# Altium project LimeNet-Micro_2v1-SDR.PrjPcb (part 3 of 10)

## Sheet 09_Misc.SchDoc: Misc
size A3; Organization: Lime Microsystems; Address1: Surrey Tech Centre; Address2: Guildford GU2 7YG; Address3: Surrey; Address4: United Kingdom; Revision: v2.1; SheetNumber: 9; SheetTotal: 15
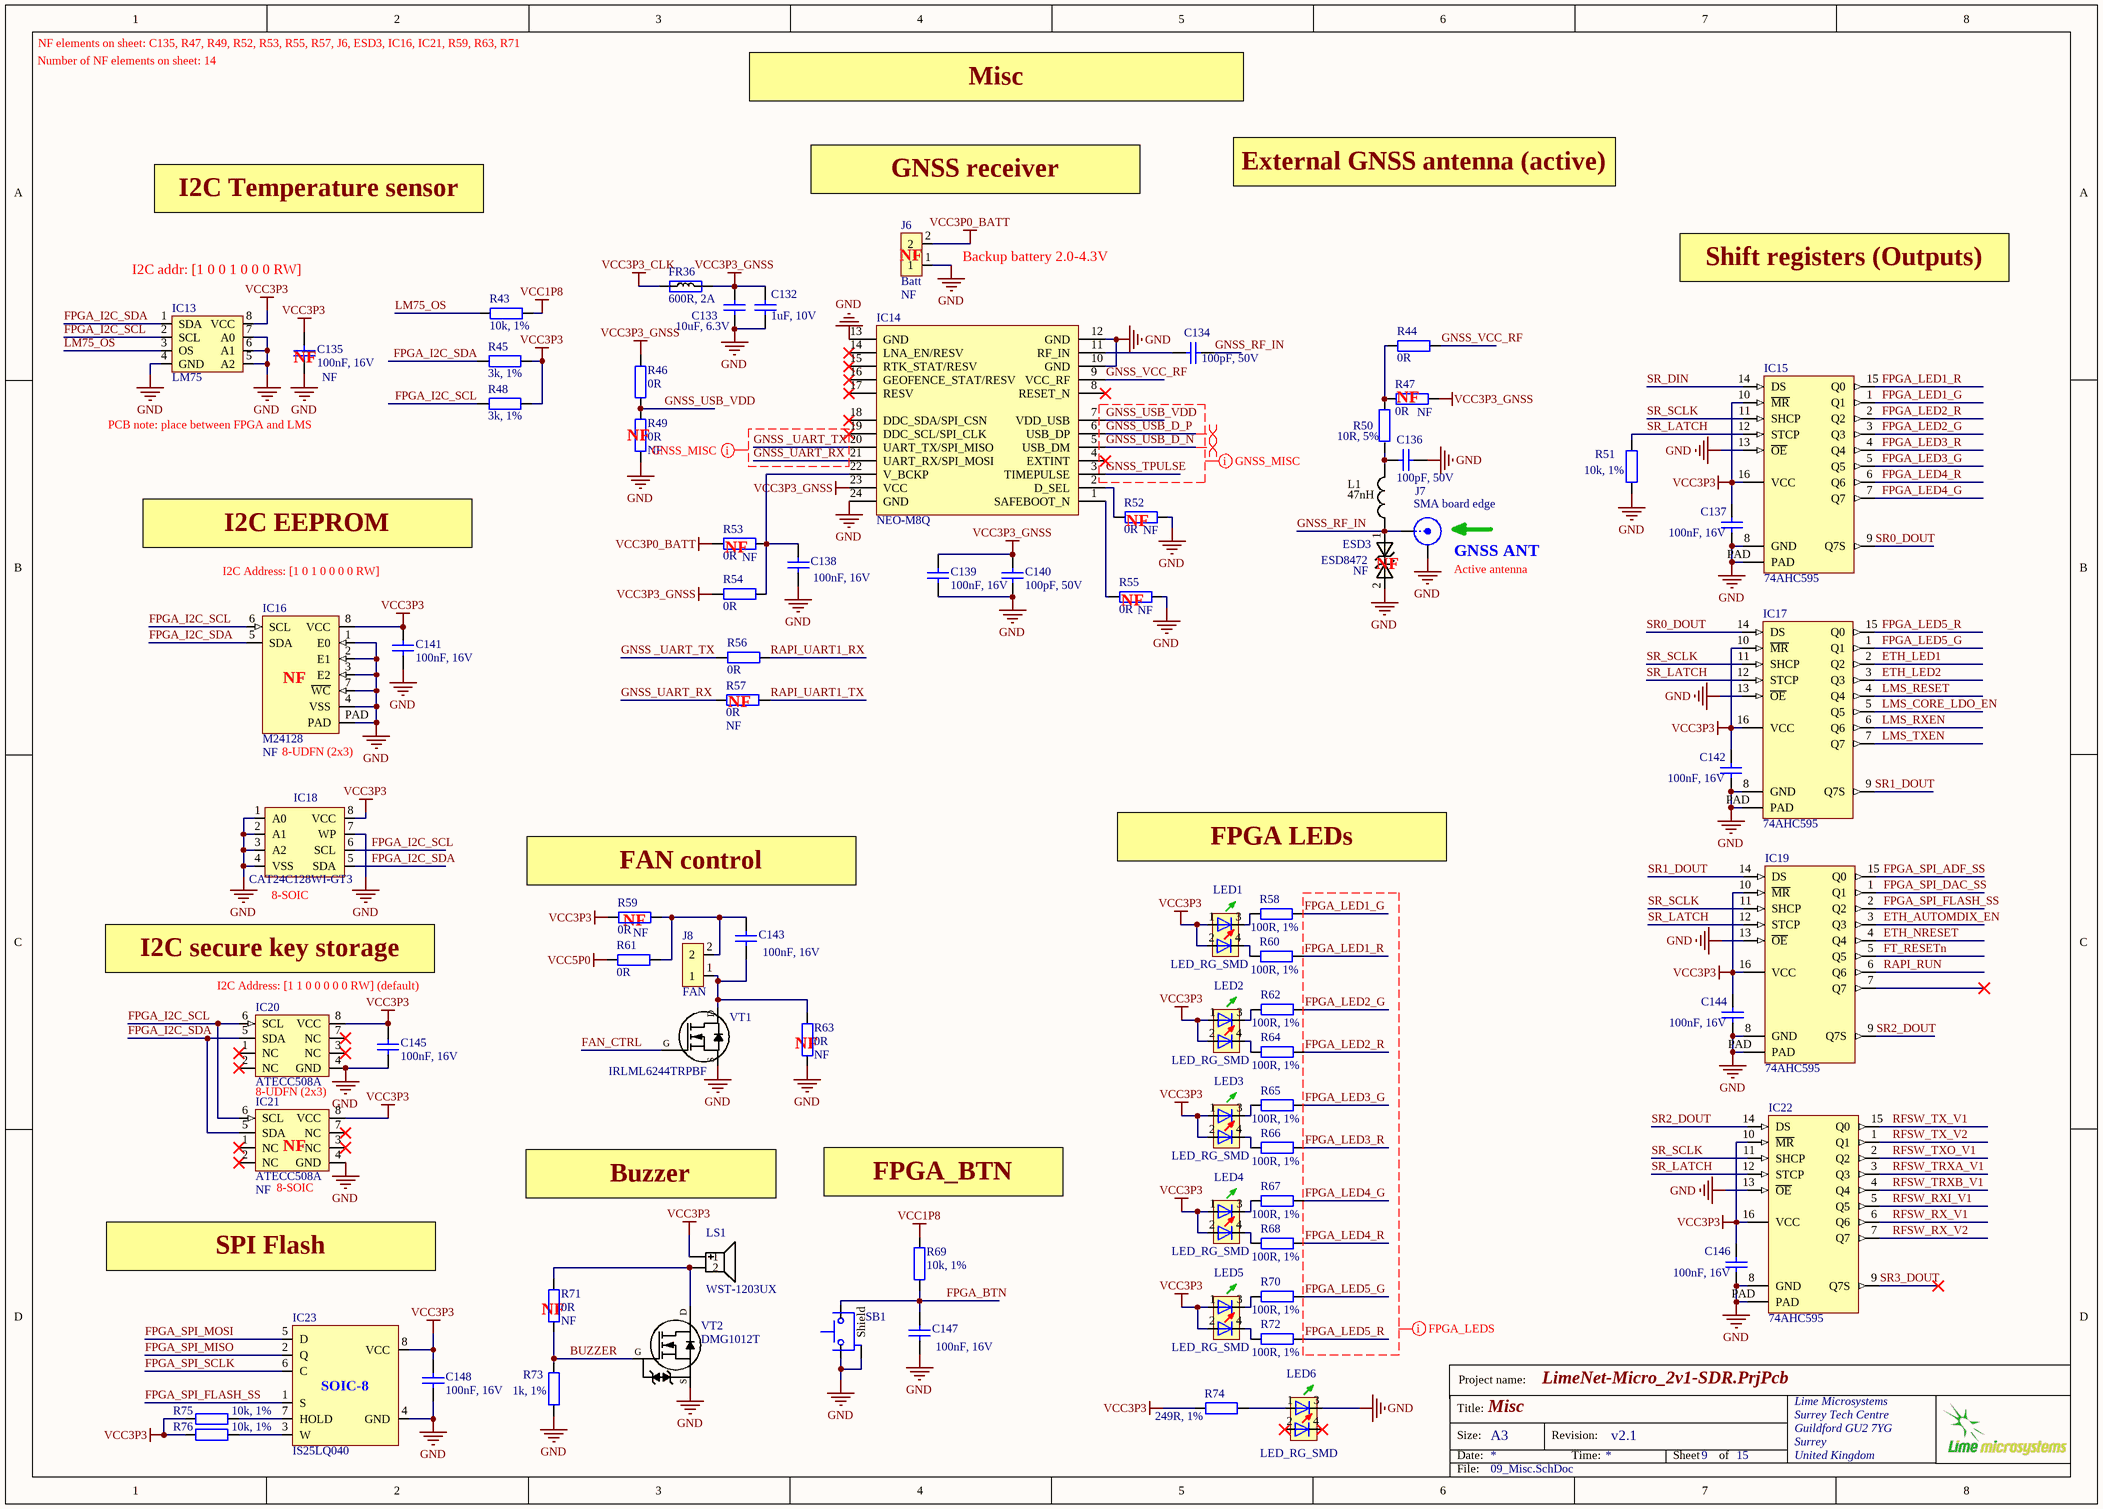
[diagram p8: 09_Misc.SchDoc]

### Parts
C132  1uF, 10V  [CAP0402]
C133  10uF, 6.3V  [CAP0603]
C134  100pF, 50V  [CAP0402]
C135  100nF, 16V  Assembly Info: NF  [CAP0402]
C136  100pF, 50V  [CAP0402]
C137  100nF, 16V  [CAP0402]
C138  100nF, 16V  [CAP0402]
C139  100nF, 16V  [CAP0402]
C140  100pF, 50V  [CAP0402]
C141  100nF, 16V  [CAP0402]
C142  100nF, 16V  [CAP0402]
C143  100nF, 16V  [CAP0402]
C144  100nF, 16V  [CAP0402]
C145  100nF, 16V  [CAP0402]
C146  100nF, 16V  [CAP0402]
C147  100nF, 16V  [CAP0402]
C148  100nF, 16V  [CAP0402]
ESD3  ESD8472  Assembly Info: NF  [ESD8472_X3DFN2]
FR36  600R, 2A  [RES0805]
IC13  LM75  [HWSON8_LM75]
IC14  NEO-M8Q  [NEO-7M/8M]
IC15  74AHC595  [74HC595BQ,115]
IC16  M24128  Assembly Info: NF  [M24128-DFMC6TG]
IC17  74AHC595  [74HC595BQ,115]
IC18  CAT24C128WI-GT3  [SOIC127P600-8DL_v2]
IC19  74AHC595  [74HC595BQ,115]
IC20  ATECC508A  [ATECC508A_UDFN8]
IC21  ATECC508A  Assembly Info: NF  [SOIC127P600-8DL_v2]
IC22  74AHC595  [74HC595BQ,115]
IC23  IS25LQ040  [M25P40-VMN6TPB_SO8N]
J6  Batt  Assembly Info: NF  [HDR_1x2]
J7  SMA board edge  [SMA_connector_board_edge_SM]
J8  FAN  [HDR_1x2]
L1  47nH  [RES0402]
LED1  LED_RG_SMD  [LED-2x0603]
LED2  LED_RG_SMD  [LED-2x0603]
LED3  LED_RG_SMD  [LED-2x0603]
LED4  LED_RG_SMD  [LED-2x0603]
LED5  LED_RG_SMD  [LED-2x0603]
LED6  LED_RG_SMD  [LED-2x0603]
LS1  WST-1203UX  [BUZZER_WST-1203UX]
R43  10k, 1%  [RES0402]
R44  0R  [RES0402]
R45  3k, 1%  [RES0402]
R46  0R  [RES0402]
R47  0R  Assembly Info: NF  [RES0402]
R48  3k, 1%  [RES0402]
R49  0R  Assembly Info: NF  [RES0402]
R50  10R, 5%  [RES0402]
R51  10k, 1%  [RES0402]
R52  0R  Assembly Info: NF  [RES0402]
R53  0R  Assembly Info: NF  [RES0402]
R54  0R  [RES0402]
R55  0R  Assembly Info: NF  [RES0402]
R56  0R  [RES0402]
R57  0R  Assembly Info: NF  [RES0402]
R58  100R, 1%  [RES0402]
R59  0R  Assembly Info: NF  [RES0402]
R60  100R, 1%  [RES0402]
R61  0R  [RES0402]
R62  100R, 1%  [RES0402]
R63  0R  Assembly Info: NF  [RES0402]
R64  100R, 1%  [RES0402]
R65  100R, 1%  [RES0402]
R66  100R, 1%  [RES0402]
R67  100R, 1%  [RES0402]
R68  100R, 1%  [RES0402]
R69  10k, 1%  [RES0402]
R70  100R, 1%  [RES0402]
R71  0R  Assembly Info: NF  [RES0402]
R72  100R, 1%  [RES0402]
R73  1k, 1%  [RES0402]
R74  249R, 1%  [RES0402]
R75  10k, 1%  [RES0402]
R76  10k, 1%  [RES0402]
SB1  Switch tactile right edge  [SW_TACTILE_RIGHT_EDGE]  (value not drawn)
VT1  IRLML6244TRPBF  [SOT23-3]
VT2  DMG1012T  [SOT523]

### Nets
GND: C132.1 C133.1 C135.2 C136.2 C137.1 C138.2 C139.1 C140.2 C141.2 C142.1 C144.1 C145.2 C146.1 C147.2 C148.2 ESD3.2 IC13.4(GND) IC13.5(A2) IC13.6(A1) IC13.7(A0) IC14.10(GND) IC14.12(GND) IC14.13(GND) IC14.24(GND) IC15.8(GND) IC15.13(~{OE}) IC15.PAD IC16.1(E0) IC16.2(E1) IC16.3(E2) IC16.4(VSS) IC16.7(~{WC}) IC16.PAD IC17.8(GND) IC17.13(~{OE}) IC17.PAD IC18.1(A0) IC18.2(A1) IC18.3(A2) IC18.4(VSS) IC18.7(WP) IC19.8(GND) IC19.13(~{OE}) IC19.PAD IC20.4(GND) IC21.4(GND) IC22.8(GND) IC22.13(~{OE}) IC22.PAD IC23.4(GND) J6.1 J7.2(Y) LED6.3 R49.2 R51.2 R52.1 R55.1 R63.1 R73.2 SB1.2 SB1.Shield VT1.S VT2.S
VCC1P8: R43.2 R69.1
VCC3P0_BATT: J6.2 R53.2
VCC3P3: C135.1 C137.2 C141.1 C142.2 C144.2 C145.1 C146.2 C148.1 IC13.8(VCC) IC15.10(~{MR}) IC15.16(VCC) IC16.8(VCC) IC17.10(~{MR}) IC17.16(VCC) IC18.8(VCC) IC19.10(~{MR}) IC19.16(VCC) IC20.8(VCC) IC21.8(VCC) IC22.10(~{MR}) IC22.16(VCC) IC23.8(VCC) LED1.1 LED1.2 LED2.1 LED2.2 LED3.1 LED3.2 LED4.1 LED4.2 LED5.1 LED5.2 LS1.1 R45.1 R48.1 R59.1 R74.1 R75.1 R76.1
VCC3P3_CLK: FR36.1
VCC3P3_GNSS: C132.2 C133.2 C139.2 C140.1 FR36.2 IC14.23(VCC) R46.2 R47.1 R54.2
VCC5P0: R61.1
BUZZER: R71.1 R73.1 VT2.G
ETH_AUTOMDIX_EN: IC19.3(Q3)
ETH_LED1: IC17.2(Q2)
ETH_LED2: IC17.3(Q3)
ETH_NRESET: IC19.4(Q4)
FAN_CTRL: VT1.G
FPGA_BTN: C147.1 R69.2 SB1.1
FPGA_I2C_SCL: IC13.2(SCL) IC16.6(SCL) IC18.6(SCL) IC20.6(SCL) IC21.6(SCL) R48.2
FPGA_I2C_SDA: IC13.1(SDA) IC16.5(SDA) IC18.5(SDA) IC20.5(SDA) IC21.5(SDA) R45.2
FPGA_LED1_G: IC15.1(Q1) R58.2
FPGA_LED1_R: IC15.15(Q0) R60.2
FPGA_LED2_G: IC15.3(Q3) R62.2
FPGA_LED2_R: IC15.2(Q2) R64.2
FPGA_LED3_G: IC15.5(Q5) R65.2
FPGA_LED3_R: IC15.4(Q4) R66.2
FPGA_LED4_G: IC15.7(Q7) R67.2
FPGA_LED4_R: IC15.6(Q6) R68.2
FPGA_LED5_G: IC17.1(Q1) R70.2
FPGA_LED5_R: IC17.15(Q0) R72.2
FPGA_SPI_ADF_SS: IC19.15(Q0)
FPGA_SPI_DAC_SS: IC19.1(Q1)
FPGA_SPI_FLASH_SS: IC19.2(Q2) IC23.1(S)
FPGA_SPI_MISO: IC23.2(Q)
FPGA_SPI_MOSI: IC23.5(D)
FPGA_SPI_SCLK: IC23.6(C)
FT_RESETn: IC19.5(Q5)
GNSS _UART_TX: IC14.20(UART_TX/SPI_MISO) R56.2
GNSS_RF_IN: C134.1 ESD3.1 J7.1(X) L1.1
GNSS_TPULSE: IC14.3(TIMEPULSE)
GNSS_UART_RX: IC14.21(UART_RX/SPI_MOSI) R57.1
GNSS_USB_D_N: IC14.5(USB_DM)
GNSS_USB_D_P: IC14.6(USB_DP)
GNSS_USB_VDD: IC14.7(VDD_USB) R46.1 R49.1
GNSS_VCC_RF: IC14.9(VCC_RF) R44.2
LM75_OS: IC13.3(OS) R43.1
LMS_CORE_LDO_EN: IC17.5(Q5)
LMS_RESET: IC17.4(Q4)
LMS_RXEN: IC17.6(Q6)
LMS_TXEN: IC17.7(Q7)
RAPI_RUN: IC19.6(Q6)
RAPI_UART1_RX: R56.1
RAPI_UART1_TX: R57.2
RFSW_RX_V1: IC22.6(Q6)
RFSW_RX_V2: IC22.7(Q7)
RFSW_RXI_V1: IC22.5(Q5)
RFSW_TRXA_V1: IC22.3(Q3)
RFSW_TRXB_V1: IC22.4(Q4)
RFSW_TX_V1: IC22.15(Q0)
RFSW_TX_V2: IC22.1(Q1)
RFSW_TXO_V1: IC22.2(Q2)
SR0_DOUT: IC15.9(Q7S) IC17.14(DS)
SR1_DOUT: IC17.9(Q7S) IC19.14(DS)
SR2_DOUT: IC19.9(Q7S) IC22.14(DS)
SR3_DOUT: IC22.9(Q7S)
SR_DIN: IC15.14(DS)
SR_LATCH: IC15.12(STCP) IC17.12(STCP) IC19.12(STCP) IC22.12(STCP) R51.1
SR_SCLK: IC15.11(SHCP) IC17.11(SHCP) IC19.11(SHCP) IC22.11(SHCP)
NetC134_2: C134.2 IC14.11(RF_IN)
NetC136_1: C136.1 L1.2 R50.2
NetC138_1: C138.1 IC14.22(V_BCKP) R53.1 R54.1
NetC143_1: C143.1 J8.2 R59.2 R61.2
NetC143_2: C143.2 J8.1 R63.2 VT1.D
NetIC14_1: IC14.1(SAFEBOOT_N) R55.2
NetIC14_2: IC14.2(D_SEL) R52.2
NetIC23_3: IC23.3(W) R76.2
NetIC23_7: IC23.7(HOLD) R75.2
NetLED1_3: LED1.3 R58.1
NetLED1_4: LED1.4 R60.1
NetLED2_3: LED2.3 R62.1
NetLED2_4: LED2.4 R64.1
NetLED3_3: LED3.3 R65.1
NetLED3_4: LED3.4 R66.1
NetLED4_3: LED4.3 R67.1
NetLED4_4: LED4.4 R68.1
NetLED5_3: LED5.3 R70.1
NetLED5_4: LED5.4 R72.1
NetLED6_1: LED6.1 R74.2
NetLS1_2: LS1.2 R71.2 VT2.D
NetR44_1: R44.1 R47.2 R50.1

Not connected (* = marked no-connect by the designer): IC14 4(EXTINT)* 8(RESET_N)* 14(LNA_EN/RESV)* 15(RTK_STAT/RESV)* 16(GEOFENCE_STAT/RESV)* 17(RESV)* 18(DDC_SDA/SPI_CSN)* 19(DDC_SCL/SPI_CLK)*; IC19 7(Q7)*; IC20 1(NC)* 2(NC)* 3(NC)* 7(NC)*; IC21 1(NC)* 2(NC)* 3(NC)* 7(NC)*; LED6 2* 4*

### Layout directives
net class FPGA_LEDS: FPGA_LED1_G, FPGA_LED1_R, FPGA_LED2_G, FPGA_LED2_R, FPGA_LED3_G, FPGA_LED3_R, FPGA_LED4_G, FPGA_LED4_R, FPGA_LED5_G, FPGA_LED5_R
differential pair: GNSS_USB_D_N, GNSS_USB_D_P
net class GNSS_MISC: GNSS _UART_TX, GNSS_TPULSE, GNSS_UART_RX, GNSS_USB_D_N, GNSS_USB_D_P, GNSS_USB_VDD

### Notes on the sheet
- NF elements on sheet: C135, R47, R49, R52, R53, R55, R57, J6, ESD3, IC16, IC21, R59, R63, R71
- Number of NF elements on sheet: 14
- Misc
- External GNSS antenna (active)
- I2C Temperature sensor
- (near J6) GNSS receiver
- I2C addr: [1 0 0 1 0 0 0 RW]
- (near J6) NF
- (near J6) Backup battery 2.0-4.3V
- Shift registers (Outputs)
- (near C135) NF
- PCB note: place between FPGA and LMS
- (near R49) NF
- NF
- I2C EEPROM
- I2C Address: [1 0 1 0 0 0 0 RW]
- (near R53) NF
- (near R52) NF
- (near ESD3) NF
- (near J7) GNSS ANT
- (near J7) Active antenna
- (near R55) NF
- (near IC16) NF
- (near R57) NF
- (near IC16) 8-UDFN (2x3)
- FPGA LEDs
- (near IC18) 8-SOIC
- FAN control
- (near R59) NF
- I2C secure key storage
- I2C Address: [1 1 0 0 0 0 0 RW] (default)
- (near R63) NF
- 8-UDFN (2x3)
- (near IC21) NF
- (near IC21) 8-SOIC
- Buzzer
- (near R69) FPGA_BTN
- SPI Flash
- (near R71) NF
- Project name:
- Title:
- Size:
- Date:
- A3
- Revision:
- Time:
- Sheet
- of
- File:
- (in symbol M25P40) SOIC-8

### Library data of the parts
C132 = Cap_0402: CAP CER 1UF 10V X5R 0402; Manufacturer: Yageo; Part Description: 1µF 10V Ceramic Capacitor X5R 0402 (1005 Metric) 0.039" L x 0.020" W (1.00mm x 0.50mm); Manufacturer Part Number 1: CC0402MRX5R6BB105; Notification: Current market demand for these product types have resulted in fluctuating and extending lead times. Lead times may differ.; Tolerance: ±20%; Value: 1uF, 10V; Supplier 1: Digi-Key; Supplier Part Number 1: 311-1732-1-ND; RoHS: RoHS Compliant; Applications: General Purpose; Category: Capacitors; ComponentLink1Description: http://www.yageo.com/documents/recent/UPY-GPHC_X5R_4V-to-50V_25.pdf; ComponentLink1URL: http://www.yageo.com/documents/recent/UPY-GPHC_X5R_4V-to-50V_25.pdf; Failure Rate: -; Features: -; Height - Seated (Max): -; Lead Spacing: -; Lead Style: -; Mounting Type: Surface Mount, MLCC; Operating Temperature: -55°C ~ 85°C; Package / Case: 0402 (1005 Metric); Packaging: Cut Tape (CT); Part Status: Active; Pricing 1: 1=0.22, 10=0.156, 100=0.0732, 500=0.0513, 1000=0.04248, 2500=0.03953, 5000=0.03617 (USD); Ratings: -; Size / Dimension: 0.039" L x 0.020" W (1.00mm x 0.50mm); Stock 1: 69600; Temperature Coefficient: X5R; Thickness (Max): 0.022" (0.55mm); Voltage - Rated: 10V
C133 = Cap_0603: Manufacturer Part Number 1: CC0603MRX5R5BB106; Manufacturer: Yageo; Part Description: 10µF ±20% 6.3V X5R Ceramic Capacitor -55°C ~ 85°C Surface Mount, MLCC 0603 (1608 Metric) 0.063" L x 0.031" W (1.60mm x 0.80mm); Capacitance: 10µF; Tolerance: ±20%; Supplier 1: Digi-Key; Supplier Part Number 1: 311-1448-2-ND; Package / Case: 0603 (1608 Metric); Category: Capacitors; Voltage - Rated: 6.3V; Value: 10uF, 6.3V
C134 C136 C140 = Cap_0402: Manufacturer Part Number 1: CC0402JRNPO9BN101; Manufacturer: Yageo; Part Description: 100pF ±5% 50V C0G, NP0 Ceramic Capacitor -55°C ~ 125°C Surface Mount, MLCC 0402 (1005 Metric) 0.039" L x 0.020" W (1.00mm x 0.50mm); Tolerance: ±5%; Temperature Coefficient: C0G, NP0; Value: 100pF, 50V; Capacitance: 100pF; Thickness (Max): 0.022" (0.55mm); Size / Dimension: 0.039" L x 0.020" W (1.00mm x 0.50mm); RoHS: RoHS Compliant; Ratings: -; Package / Case: 0402 (1005 Metric); Mounting Type: Surface Mount, MLCC; Height - Seated (Max): -; Features: -; Lead Spacing: -; Voltage - Rated: 50V; Operating Temperature: -55°C ~ 125°C; Packaging: Cut Tape (CT); Applications: General Purpose; Lead Style: -; Supplier 1: Digi-Key; Category: Capacitors; Supplier Part Number 1: 311-1024-1-ND
C135 C138 C141 C143 C145 = Cap_0603: Manufacturer Part Number 1: GRM155R71C104KA88D; Part Description: CAP CER 0.1UF 16V X7R 0402; Brand: Murata Electronics; Tolerance: 10 %; Type: General Purpose MLCC; Capacitance: 0.1 uF; Temperature Coefficient / Code: +/- 15 %; Case Height: 0.5 mm; Case Length: 1 mm; Dielectric: X7R; Supplier 1: Mouser; Supplier Part Number 1: 81-GRM155R71C104KA88; Case Code - in: 0402; Manufacturer: Murata Electronics; Category: Multilayer Ceramic Capacitors MLCC - SMD/SMT; Voltage Rating DC: 16 V; Value: 100nF, 16V; Manufacturer Part Number: GRM155R71C104KA88D; Case Code - mm: 1005; Case Width: 0.5 mm; Maximum Operating Temperature: + 125 C; Minimum Operating Temperature: - 55 C; Minimum Order Quantity: 1; Operating Temperature Range: - 55 C to + 125 C; Package / Case: 0402 (1005 metric); Packaging: Reel; Product: General Type MLCCs; Product Category: Low & Medium Capacitance SMD Ceramic Chip Capacitors; Reeling: True; RoHS - Mouser: Y; RoHS: RoHS Compliant; Series: GRM; Standard Pack Qty: 10000; Termination Style: SMD/SMT
C137 C139 C142 C144 C146 = Cap_0402: Manufacturer: Murata Electronics; Manufacturer Part Number: GRM155R71C104KA88D; Part Description: CAP CER 0.1UF 16V X7R 0402; Tolerance: 10 %; Type: General Purpose MLCC; Capacitance: 0.1 uF; Case Length: 1 mm; Dielectric: X7R; Case Height: 0.5 mm; Temperature Coefficient / Code: +/- 15 %; Value: 100nF, 16V; Supplier 1: Mouser; Supplier Part Number 1: 81-GRM155R71C104KA88; Case Code - in: 0402; RoHS: RoHS Compliant; Operating Temperature Range: - 55 C to + 125 C; Series: GRM; Termination Style: SMD/SMT; Package / Case: 0402 (1005 metric); Voltage Rating DC: 16 V; Maximum Operating Temperature: + 125 C; Case Code - mm: 1005; Minimum Operating Temperature: - 55 C; Product Category: Low & Medium Capacitance SMD Ceramic Chip Capacitors; Packaging: Reel; Product: General Type MLCCs; Category: Multilayer Ceramic Capacitors MLCC - SMD/SMT; Brand: Murata Electronics; Case Width: 0.5 mm; RoHS - Mouser: Y; Standard Pack Qty: 10000; Minimum Order Quantity: 1; Reeling: True; Manufacturer Part Number 1: GRM155R71C104KA88D
C147 C148 = Cap_0603: Manufacturer Part Number 1: GRM155R71C104KA88D; Part Description: CAP CER 0.1UF 16V X7R 0402; Brand: Murata Electronics; Tolerance: 10 %; Type: General Purpose MLCC; Capacitance: 0.1 uF; Temperature Coefficient / Code: +/- 15 %; Supplier 1: Mouser; Supplier Part Number 1: 81-GRM155R71C104KA88; Case Code - in: 0402; Manufacturer: Murata Electronics; Category: Multilayer Ceramic Capacitors MLCC - SMD/SMT; Voltage Rating DC: 16 V; Value: 100nF, 16V; Manufacturer Part Number: GRM155R71C104KA88D
ESD3 = ESD8472: Manufacturer: ON Semiconductor; Manufacturer Part Number 1: ESD8472MUT5G; Part Description: TVS DIODE 5.3VWM 14VC X3DFN2; Voltage - Reverse Standoff (Typ): 5.3V (Max); Voltage - Breakdown (Min): 7V; Voltage - Clamping (Max) @ Ipp: 14V; Current - Peak Pulse (10/1000µs): 3A (8/20µs); Power Line Protection: No; Capacitance @ Frequency: 0.2pF @ 1MHz; Supplier 1: Digi-Key; RoHS: RoHS Compliant; Category: Circuit Protection; Stock 1: 2295; Pricing 1: 1=0.39, 10=0.315, 100=0.2142, 500=0.16068, 1000=0.12051 (USD); Packaging: Cut Tape (CT); Part Status: Active; Type: Zener; Power - Peak Pulse: -; Applications: Automotive, RF Antenna; Operating Temperature: -55°C ~ 150°C (TJ); Mounting Type: Surface Mount; Package / Case: 2-XFDFN; Supplier Device Package: 2-X3DFN (0.62x0.32); ComponentLink1URL: http://www.onsemi.com/pub/Collateral/ESD8472-D.PDF; ComponentLink1Description: http://www.onsemi.com/pub/Collateral/ESD8472-D.PDF; Supplier Part Number 1: ESD8472MUT5GOSCT-ND
FR36 = Ferrite: Manufacturer Part Number 1: MPZ2012S601AT000; Manufacturer: TDK Corporation; Part Description: FERRITE BEAD 600 OHM 0805 1LN; DC Resistance (DCR): 100 mOhm Max; Filter Type: Differential Mode - Single; Impedance @ Frequency: 600 Ohm @ 100MHz; Supplier 1: Digi-Key; Supplier Part Number 1: 445-2206-2-ND; Value: 600R, 2A; Category: Filters; Current Rating: 2A; Height (Max): 0.041" (1.05mm); Mounting Type: Surface Mount; Package / Case: 0805 (2012 Metric); Packaging: Tape & Reel (TR); RoHS: RoHS Compliant; Size / Dimension: 0.079" L x 0.049" W (2.00mm x 1.25mm)
IC13 = LM75: Manufacturer: NXP Semiconductors; Manufacturer Part Number 1: LM75BTP,147; Part Description: SENSOR TEMPERATURE I2C 8HWSON; Sensing Temperature - Local: -55°C ~ 125°C; Output Type: I²C; Accuracy - Highest (Lowest): ±2°C (±3°C); Voltage - Supply: 2.8 V ~ 5.5 V; Test Condition: -25°C ~ 100°C (-55°C ~ 125°C); Sensor Type: Digital, Local; Resolution: 10 b; Supplier 1: Digi-Key; Operating Temperature: -55°C ~ 125°C; Features: Output Switch, Programmable Limit, Shutdown Mode; Supplier Device Package: 8-HWSON (2x3); Sensing Temperature - Remote: -; Category: Sensors, Transducers; Packaging: Tape & Reel (TR); RoHS: RoHS Compliant; Package / Case: 8-WFDFN Exposed Pad; Supplier Part Number 1: 568-9815-2-ND
IC14 = NEO-M8P_M8M: GNSS engine for GPS/QZSS, GLONASS; Manufacturer: u-blox; Manufacturer Part Number: NEO-M8Q-0; ComponentLink1URL: https://www.u-blox.com/en/product/neo-7-series; ComponentLink2Description: Datasheet; ComponentLink1Description: https://www.u-blox.com/en/product/neo-7-series; ComponentLink3URL: https://www.u-blox.com/sites/default/files/NEO-M8-FW3_DataSheet_(UBX-15031086).pdf; ComponentLink3Description: https://www.u-blox.com/sites/default/files/NEO-M8-FW3_DataSheet_(UBX-15031086).pdf; Supplier 1: Digi-Key; Supplier Part Number 1: 672-1009-1-ND; Stock 1: 5505; Pricing 1: 1=25, 10=20.244, 50=16.6216, 100=13.314 (USD); Value: NEO-M8Q
IC15 = 74HC595BQ,115: Part Description: C 8BIT SHIFT REGISTER 16-DHVQFN; Manufacturer: Nexperia USA Inc.; Manufacturer Part Number 1: 74AHC595BQ,115; Logic Type: Shift Register; Output Type: Tri-State; Function: Serial to Parallel, Serial; Voltage - Supply: 2 V ~ 5.5 V; Supplier 1: Digi-Key; Supplier Part Number 1: 1727-6021-2-ND; RoHS: RoHS Compliant; Category: Integrated Circuits (ICs); Stock 1: 24000; Pricing 1: 3000=0.17949, 6000=0.16791, 15000=0.15633, 30000=0.14822 (USD); Packaging: Tape & Reel (TR); Part Status: Active; Operating Temperature: -40°C ~ 125°C; Mounting Type: Surface Mount; Package / Case: 16-VFQFN Exposed Pad; Supplier Device Package: 16-DHVQFN (2.5x3.5); Base Part Number: 74AHC595; ComponentLink1URL: https://assets.nexperia.com/documents/data-sheet/74AHC_AHCT595.pdf; ComponentLink1Description: https://assets.nexperia.com/documents/data-sheet/74AHC_AHCT595.pdf
IC16 = M24128-DFMC6TG: Manufacturer: STMicroelectronics; Part Description: EEPROM Memory IC 128Kb (16K x 8) I²C 1MHz 450ns 8-UFDFPN (2x3); Memory Type: Non-Volatile; Memory Format: EEPROM; Memory Size: 128Kb (16K x 8); Write Cycle Time - Word, Page: 5ms; Memory Interface: I²C; Voltage - Supply: 1.7 V ~ 5.5 V; Supplier 1: Digi-Key; Manufacturer Part Number 1: M24128-DFMC6TG; RoHS: RoHS Compliant; Category: Integrated Circuits (ICs); Stock 1: 5894; Pricing 1: 1=0.35, 10=0.348, 100=0.2854, 500=0.27748, 1000=0.27004 (USD); Packaging: Cut Tape (CT); Part Status: Active; Technology: EEPROM; Operating Temperature: -40°C ~ 85°C (TA); Mounting Type: Surface Mount; Package / Case: 8-UFDFN Exposed Pad; Supplier Device Package: 8-UFDFPN (2x3); ComponentLink1URL: http://www.st.com/content/ccc/resource/technical/document/datasheet/59/05/c9/5b/7b/41/48/b6/CD00259167.pdf/files/CD00259167.pdf/jcr:content/translations/en.CD00259167.pdf; ComponentLink1Description: http://www.st.com/content/ccc/resource/technical/document/datasheet/59/05/c9/5b/7b/41/48/b6/CD00259167.pdf/files/CD00259167.pdf/jcr:content/translations/en.CD00259167.pdf; Supplier Part Number 1: 497-15739-1-ND
IC17 IC19 IC22 = 74HC595BQ,115: Part Description: C 8BIT SHIFT REGISTER 16-DHVQFN; Manufacturer: Nexperia USA Inc.; Manufacturer Part Number 1: 74AHC595BQ,115; Function: Serial to Parallel, Serial; Logic Type: Shift Register; Output Type: Tri-State; Voltage - Supply: 2 V ~ 5.5 V; Base Part Number: 74AHC595; Category: Integrated Circuits (ICs); ComponentLink1Description: https://assets.nexperia.com/documents/data-sheet/74AHC_AHCT595.pdf; ComponentLink1URL: https://assets.nexperia.com/documents/data-sheet/74AHC_AHCT595.pdf; Mounting Type: Surface Mount; Operating Temperature: -40°C ~ 125°C; Package / Case: 16-VFQFN Exposed Pad; Packaging: Tape & Reel (TR); Part Status: Active; Pricing 1: 3000=0.17949, 6000=0.16791, 15000=0.15633, 30000=0.14822 (USD); RoHS: RoHS Compliant; Stock 1: 24000; Supplier 1: Digi-Key; Supplier Device Package: 16-DHVQFN (2.5x3.5); Supplier Part Number 1: 1727-6021-2-ND
IC18 = 24FC64F: Part Description: EEPROM Memory IC 128Kb (16K x 8) I²C 1MHz 400ns 8-SOIC; Manufacturer: ON Semiconductor; Memory Type: Non-Volatile; Memory Format: EEPROM; Memory Size: 128Kb (16K x 8); Write Cycle Time - Word, Page: 5ms; Memory Interface: I²C; Voltage - Supply: 1.8 V ~ 5.5 V; Supplier 1: Digi-Key; Supplier Part Number 1: CAT24C128WI-GT3CT-ND; Manufacturer Part Number 1: CAT24C128WI-GT3; RoHS: RoHS Compliant; Category: Integrated Circuits (ICs); Stock 1: 14804; Pricing 1: 1=0.31, 10=0.309, 100=0.2532, 500=0.24616, 1000=0.23956 (USD); Packaging: Cut Tape (CT); Part Status: Active; Technology: EEPROM; Operating Temperature: -40°C ~ 85°C (TA); Mounting Type: Surface Mount; Package / Case: 8-SOIC (0.154", 3.90mm Width); Supplier Device Package: 8-SOIC; Base Part Number: CAT24C128; ComponentLink1URL: http://www.onsemi.com/pub/Collateral/CAT24C128-D.PDF; ComponentLink1Description: http://www.onsemi.com/pub/Collateral/CAT24C128-D.PDF
IC20 = ATECC508A_authentication_IC: Manufacturer: Microchip; Manufacturer Part Number 1: ATECC508A-MAHDA-S; Part Description: Authentication Chip IC Networking and Communications 8-UDFN (2x3); Supplier 1: Digi-Key; Stock 1: 27941; Pricing 1: 1=0.73, 25=0.7064 (USD); Supplier Part Number 1: ATECC508A-MAHDA-SDKR-ND
IC21 = ATECC508A_authentication_IC: Manufacturer: Microchip Technology; Manufacturer Part Number 1: ATECC508A-SSHDA-T; Part Description: Authentication Chip IC Networking and Communications 8-SOIC; Type: Authentication Chip; Mounting Type: Surface Mount; Supplier Part Number 1: ATECC508A-SSHDA-TCT-ND; Applications: Networking and Communications; Category: Integrated Circuits (ICs); Supplier 1: Digi-Key; Base Part Number: ATECC508; RoHS: RoHS Compliant; Package / Case: 8-SOIC (0.154", 3.90mm Width); Packaging: Cut Tape (CT); Supplier Device Package: 8-SOIC; Part Status: Active
IC23 = M25P40: Manufacturer Part Number 1: IS25LQ040B-JNLE; Manufacturer: ISSI, Integrated Silicon Solution Inc; Part Description: FLASH - NOR Memory IC 4Mb (512K x 8) SPI - Quad I/O 104MHz  8-SOIC; Memory Type: Non-Volatile; Memory Format: FLASH; Memory Size: 4Mb (512K x 8); Write Cycle Time - Word, Page: 800µs; Memory Interface: SPI - Quad I/O; Voltage - Supply: 2.3 V ~ 3.6 V; Category: Integrated Circuits (ICs); Supplier Part Number 1: 706-1316-ND; Supplier 1: Digi-Key; RoHS: RoHS Compliant; Packaging: Bulk; Part Status: Active; Technology: FLASH - NOR; Operating Temperature: -40°C ~ 105°C (TA); Mounting Type: Surface Mount; Package / Case: 8-SOIC (0.154", 3.90mm Width); Supplier Device Package: 8-SOIC; Value: IS25LQ040
J6 J8 = Jumper: Manufacturer Part Number 1: 961102-6404-AR; Part Description: 2 Positions Header, Unshrouded Connector 0.100" (2.54mm) Through Hole Gold; Manufacturer: 3M; Connector Type: Header, Unshrouded; Supplier 1: Digi-Key; Supplier Part Number 1: 3M9447-ND; Contact Type: Male Pin; Color: Black; Mounting Type: Through Hole; Category: Connectors, Interconnects; Contact Finish: Gold
J7 = RF_IF_connector: CONN SMA JACK STR 50OHM EDGE MNT; Manufacturer: RF Solutions; Manufacturer Part Number 1: CON-SMA-EDGE-S; Part Description: SMA Connector Jack, Female Socket Board Edge, End Launch Solder; Connector Type: Jack, Female Socket; Contact Termination: Solder; Supplier 1: Digi-Key; Supplier Part Number 1: CON-SMA-EDGE-S-ND; RoHS: RoHS Compliant; Category: Connectors, Interconnects; Stock 1: 1751; Pricing 1: 1=2.1 (USD); Packaging: -; Part Status: Active; Connector Style: SMA; Shield Termination: Solder; Impedance: -; Mounting Type: Board Edge, End Launch; Mounting Feature: -; Cable Group: -; Fastening Type: Threaded; Frequency - Max: -; Features: -; Housing Color: -; Ingress Protection: -; Includes: -; Body Material: -; Body Finish: -; Center Contact Plating: -; Dielectric Material: -; Operating Temperature: -; Center Contact Material: -; Voltage Rating: -; Mating Cycles: -; Insertion Loss: -; ComponentLink1URL: http://media.digikey.com/pdf/Data%20Sheets/RF%20Solutions%20PDFs/CON-SMA-EDGE.pdf; ComponentLink1Description: http://media.digikey.com/pdf/Data%20Sheets/RF%20Solutions%20PDFs/CON-SMA-EDGE.pdf
L1 = Inductor_0603: Manufacturer: COILCRAFT; Manufacturer Part Number: 0402HP-47NXJLU; Part Description: COILCRAFT  0402HP-47NXJLU  Surface Mount High Frequency Inductor, 0402HP Series, 47 nH, 420 mA, 0402 [1005 Metric], Wirewound; SVHC: No SVHC (15-Jun-2015); Inductance Tolerance: ± 5%; High Frequency Inductor Case: 0402 [1005 Metric]; Inductor Case Style: 0402 [1005 Metric]<!--FANDB--><div class="features-and-benefits-container"></div>; Inductance: 47; DC Resistance Max: 0.58; Self Resonant Frequency Min: 2.4; Product Range: 0402; DC Current Rating: 420; Inductor Construction: Wirewound; Supplier 1: Farnell; Supplier Part Number 1: 2285856; Packaging: Cut Tape; RoHS: Y-EX; value: 47nH; Manufacturer Part Number 1: 0402HP-47NXJLU
LED1-LED6 = LED_green_red_SMD: Manufacturer Part Number 1: HSMF-C165; Manufacturer: Avago Technologies US Inc.; Part Description: LED GREEN/RED DIFFUSED 0603 SMD; Millicandela Rating: 15mcd Green, 10mcd Red; Lens Transparency: Diffused; Lens Color: White; Lens Style/Size: Rectangle with Flat Top, 1.60mm x 0.80mm; Wavelength - Peak: 570nm Green, 636nm Red; Wavelength - Dominant: 572nm Green, 621nm Red; Viewing Angle: 120°; Voltage - Forward (Vf) (Typ): 2.2V Green, 1.95V Red; Current - Test: 20mA; Color: Green, Red; Supplier 1: Digi-Key; Height (Max): 0.50mm; Packaging: Cut Tape (CT); Category: Optoelectronics; Mounting Type: Surface Mount; Package / Case: 0603 (1608 Metric); Size / Dimension: 1.60mm L x 0.80mm W; Supplier Device Package: *; RoHS: RoHS Compliant; Supplier Part Number 1: 516-1419-1-ND
LS1 = BUZZER_WST-1203UX: Manufacturer: Soberton Inc.; Part Description: Buzzers Indicator, Internally Driven Magnetic 3V 30mA 2.3kHz 82dB @ 3V, 10cm Through Hole PC Pins; Driver Circuitry: Indicator, Internally Driven; Input Type: Zero-Peak Signal; Voltage Range: 2 ~ 4V; Frequency: 2.3kHz; Operating Mode: Single Tone; Sound Pressure Level (SPL): 82dB @ 3V, 10cm; Current - Supply: 30mA; Port Location: Top; Ratings: Washable; Supplier 1: Digi-Key; Manufacturer Part Number 1: WST-1203UX; RoHS: RoHS Compliant; Category: Audio Products; Stock 1: 22696; Pricing 1: 1=1.41, 10=1.117, 25=1.0176, 50=0.9516, 100=0.8855, 250=0.80852, 500=0.7535, 1000=0.704, 5000=0.6875 (USD); Packaging: Tray; Part Status: Active; Technology: Magnetic; Duration: -; Operating Temperature: -20°C ~ 60°C; Approvals: -; Mounting Type: Through Hole; Termination: PC Pins; Size / Dimension: 0.472" Dia (12.00mm); Height - Seated (Max): 0.303" (7.70mm); ComponentLink1URL: http://cirlw3yrzg4afc1x47lv2k18.wpengine.netdna-cdn.com/wp-content/uploads/2016/12/WST-1203UX-new.pdf; ComponentLink1Description: http://cirlw3yrzg4afc1x47lv2k18.wpengine.netdna-cdn.com/wp-content/uploads/2016/12/WST-1203UX-new.pdf; Supplier Part Number 1: 433-1047-ND
R43 R51 R69 R75 R76 = Res_0402: Manufacturer: Yageo; Manufacturer Part Number 1: RC0402FR-0710KL; Part Description: RES SMD 10K OHM 1% 1/16W 0402; Temperature Coefficient: ±100ppm/°C; Power (Watts): 0.063W, 1/16W; Value: 10k, 1%; Supplier 1: Digi-Key; Supplier Part Number 1: 311-10.0KLRTR-ND; Resistance (Ohms): 10k; Packaging: Tape & Reel (TR); RoHS: RoHS Compliant; Package / Case: 0402 (1005 Metric); Tolerance: ±1%; Operating Temperature: -55°C ~ 155°C; Size / Dimension: 0.039" L x 0.020" W (1.00mm x 0.50mm); Number of Terminations: 2; Category: Resistors; Height: 0.016" (0.40mm); Supplier Device Package: 0402; Features: Moisture Resistant; Composition: Thick Film
R44 R46 R47 R49 R52-R57 R59 R61 R63 R71 = Res_0402: Manufacturer Part Number 1: RC0402JR-070RL; Manufacturer: Yageo; Part Description: RES SMD 0.0OHM JUMPER 1/16W 0402; Resistance (Ohms): 0.0; Tolerance: Jumper; Power (Watts): 0.063W, 1/16W; Value: 0R; Supplier 1: Digi-Key; Supplier Part Number 1: 311-0.0JRTR-ND; Category: Resistors; Temperature Coefficient: -; Features: Moisture Resistant; Supplier Device Package: 0402; Height: 0.016" (0.40mm); Package / Case: 0402 (1005 Metric); Operating Temperature: -55°C ~ 155°C; Size / Dimension: 0.039" L x 0.020" W (1.00mm x 0.50mm); Composition: Thick Film; Packaging: Tape & Reel (TR); Number of Terminations: 2; RoHS: RoHS Compliant
R45 R48 = Res_0402: Manufacturer: Vishay Dale; Part Description: RES SMD 3K OHM 1% 1/16W 0402; Manufacturer Part Number 1: CRCW04023K00FKED; Temperature Coefficient: ±100ppm/°C; Power (Watts): 0.063W, 1/16W; Value: 3k, 1%; Category: Resistors; Tolerance: ±1%; RoHS: RoHS Compliant; Composition: Thick Film; Number of Terminations: 2; Operating Temperature: -55°C ~ 155°C; Supplier Device Package: 0402 (1005 Metric); Supplier Part Number 1: 541-3.00KLCT-ND; Packaging: Cut Tape (CT); Supplier 1: Digi-Key; Package / Case: 0402 (1005 Metric); Features: Automotive AEC-Q200; Resistance (Ohms): 3k; Height: 0.016" (0.40mm); Size / Dimension: 0.039" L x 0.020" W (1.00mm x 0.50mm)
R50 = Res_0402: Manufacturer Part Number 1: RC0402JR-0710RL; Manufacturer: Yageo; Part Description: RES SMD 10 OHM 5% 1/16W 0402; Power (Watts): 0.063W, 1/16W; Resistance (Ohms): 10; Temperature Coefficient: ±200ppm/°C; Value: 10R, 5%; Supplier 1: Digi-Key; Supplier Part Number 1: 311-10JRTR-ND; Number of Terminations: 2; Height: 0.016" (0.40mm); RoHS: RoHS Compliant; Composition: Thick Film; Packaging: Tape & Reel (TR); Category: Resistors; Supplier Device Package: 0402; Features: Moisture Resistant; Tolerance: ±5%; Operating Temperature: -55°C ~ 155°C; Size / Dimension: 0.039" L x 0.020" W (1.00mm x 0.50mm); Package / Case: 0402 (1005 Metric)
R58 R60 R62 R64-R68 R70 R72 = Res_0402: Manufacturer Part Number 1: RMCF0402FT100R; Manufacturer: Stackpole Electronics Inc.; Part Description: RES SMD 100 OHM 1% 1/16W 0402; Power (Watts): 0.063W, 1/16W; Temperature Coefficient: ±100ppm/°C; Resistance (Ohms): 100; Value: 100R, 1%; Supplier 1: Digi-Key; Supplier Part Number 1: RMCF0402FT100RDKR-ND; Packaging: Digi-Reel®; Composition: Thick Film; Number of Terminations: 2; Package / Case: 0402 (1005 Metric); RoHS: RoHS Compliant; Category: Resistors; Size / Dimension: 0.039" L x 0.020" W (1.00mm x 0.50mm); Tolerance: ±1%; Supplier Device Package: 0402; Features: -; Height: 0.016" (0.40mm); Operating Temperature: -55°C ~ 155°C
R73 = Res_0402: Manufacturer: Stackpole Electronics Inc; Manufacturer Part Number 1: RMCF0402FT1K00; Part Description: RES SMD 1K OHM 1% 1/16W 0402; Temperature Coefficient: ±100ppm/°C; Power (Watts): 0.063W, 1/16W; Value: 1k, 1%; Supplier 1: Digi-Key; Supplier Part Number 1: RMCF0402FT1K00TR-ND; Package / Case: 0402 (1005 Metric); Supplier Device Package: 0402; Height: 0.016" (0.40mm); Size / Dimension: 0.039" L x 0.020" W (1.00mm x 0.50mm); Number of Terminations: 2; Packaging: Cut Tape (CT); Category: Resistors; Composition: Thick Film; Resistance (Ohms): 1k; Tolerance: ±1%; Features: Moisture Resistant; Operating Temperature: -55°C ~ 155°C; RoHS: RoHS Compliant
R74 = Res_0402: Manufacturer Part Number 1: RMCF0402FT249R; Manufacturer: Stackpole Electronics Inc; Part Description: RES SMD 249 OHM 1% 1/16W 0402; Resistance (Ohms): 249; Power (Watts): 0.063W, 1/16W; Temperature Coefficient: ±100ppm/°C; Value: 249R, 1%; Supplier 1: Digi-Key; Supplier Part Number 1: RMCF0402FT249RCT-ND; Package / Case: 0402 (1005 Metric); Features: -; Size / Dimension: 0.039" L x 0.020" W (1.00mm x 0.50mm); Category: Resistors; Operating Temperature: -55°C ~ 155°C; Packaging: Cut Tape (CT); Tolerance: ±1%; Supplier Device Package: 0402; RoHS: RoHS Compliant; Composition: Thick Film; Number of Terminations: 2; Height: 0.016" (0.40mm)
SB1 = Button_right_edge: Part Description: Tactile Switch SPST-NO Side Actuated Through Hole, Right Angle; Manufacturer: TE Connectivity ALCOSWITCH Switches; Manufacturer Part Number 1: 1825027-5; Circuit: SPST-NO; Switch Function: Off-Mom; Contact Rating @ Voltage: 0.05A @ 24VDC; Actuator Type: Standard; Actuator Length, Right Angle: 3.86mm; Actuator Orientation: Side Actuated; Outline: 7.10mm x 7.00mm; Illumination: Non-Illuminated; Operating Force: 160gf; Actuator Material: Polybutylene Terephthalate (PBT); Switch Travel: 0.25mm; Mechanical Life: 100,000 Cycles; Supplier 1: Digi-Key; Supplier Part Number 1: 450-1662-ND; RoHS: RoHS Compliant; Category: Switches; Stock 1: 19790; Pricing 1: 1=0.17, 10=0.169, 25=0.1628, 50=0.157, 100=0.1482, 250=0.13952, 500=0.1337, 1000=0.10173, 5000=0.08429 (USD); Packaging: Bulk; Part Status: Active; Mounting Type: Through Hole, Right Angle; Actuator Height off PCB, Vertical: -; Termination Style: PC Pin; Illumination Type, Color: -; Illumination Voltage (Nominal): -; Ingress Protection: -; Features: -; Operating Temperature: -35°C ~ 85°C; ComponentLink1URL: http://www.te.com/commerce/DocumentDelivery/DDEController?Action=srchrtrv&DocNm=1825027&DocType=Customer+Drawing&DocLang=English; ComponentLink1Description: http://www.te.com/commerce/DocumentDelivery/DDEController?Action=srchrtrv&DocNm=1825027&DocType=Customer+Drawing&DocLang=English
VT1 = NDS331N: Manufacturer: Infineon Technologies; Part Description: N-Channel 20V 6.3A (Ta) 1.3W (Ta) Surface Mount Micro3™/SOT-23; FET Type: N-Channel; Current - Continuous Drain (Id) @ 25°C: 6.3A (Ta); Drive Voltage (Max Rds On,  Min Rds On): 2.5V, 4.5V; Vgs(th) (Max) @ Id: 1.1V @ 10µA; Gate Charge (Qg) (Max) @ Vgs: 8.9nC @ 4.5V; Input Capacitance (Ciss) (Max) @ Vds: 700pF @ 16V; Vgs (Max): ±12V; Power Dissipation (Max): 1.3W (Ta); Rds On (Max) @ Id, Vgs: 21 mOhm @ 6.3A, 4.5V; Supplier 1: Digi-Key; Supplier Part Number 1: IRLML6244TRPBFTR-ND; Manufacturer Part Number 1: IRLML6244TRPBF; RoHS: RoHS Compliant; Category: Discrete Semiconductor Products; Stock 1: 21000; Pricing 1: 3000=0.09979 (USD); Packaging: Tape & Reel (TR); Part Status: Active; Technology: MOSFET (Metal Oxide); FET Feature: -; Operating Temperature: -55°C ~ 150°C (TJ); Mounting Type: Surface Mount; Supplier Device Package: Micro3™/SOT-23; Package / Case: TO-236-3, SC-59, SOT-23-3; ComponentLink1URL: https://www.infineon.com/dgdl/irlml6244pbf.pdf?fileId=5546d462533600a4015356686fed261f; ComponentLink1Description: https://www.infineon.com/dgdl/irlml6244pbf.pdf?fileId=5546d462533600a4015356686fed261f
VT2 = DMG1012T: Manufacturer: Diodes Incorporated; Manufacturer Part Number 1: DMG1012TQ-7; Part Description: N-Channel 20V 630mA (Ta) 280mW (Ta) Surface Mount SOT-523; FET Type: N-Channel; Current - Continuous Drain (Id) @ 25°C: 630mA (Ta); Drive Voltage (Max Rds On,  Min Rds On): 1.8V, 4.5V; Rds On (Max) @ Id, Vgs: 400 mOhm @ 600mA, 4.5V; Vgs(th) (Max) @ Id: 1V @ 250µA; Vgs (Max): ±6V; Power Dissipation (Max): 280mW (Ta); Supplier 1: Digi-Key; RoHS: RoHS Compliant; Category: Discrete Semiconductor Products; Stock 1: 3569; Pricing 1: 1=0.47, 10=0.424, 100=0.2375, 500=0.12722, 1000=0.08651 (USD); Packaging: Cut Tape (CT); Part Status: Active; Technology: MOSFET (Metal Oxide); FET Feature: -; Operating Temperature: -55°C ~ 150°C (TJ); Mounting Type: Surface Mount; Supplier Device Package: SOT-523; Package / Case: SOT-523; ComponentLink1URL: https://www.diodes.com/assets/Datasheets/ds31783.pdf; ComponentLink1Description: https://www.diodes.com/assets/Datasheets/ds31783.pdf; Supplier Part Number 1: DMG1012TQ-7DICT-ND